# EasyEDA Pro project QUARTZ_01.eprj

# Schematic Schematic1
Board Name: Board1; Create Date: 2024-07-29; Company: wheatfox; Drawed: wheatfox; Reviewed: wheatfox
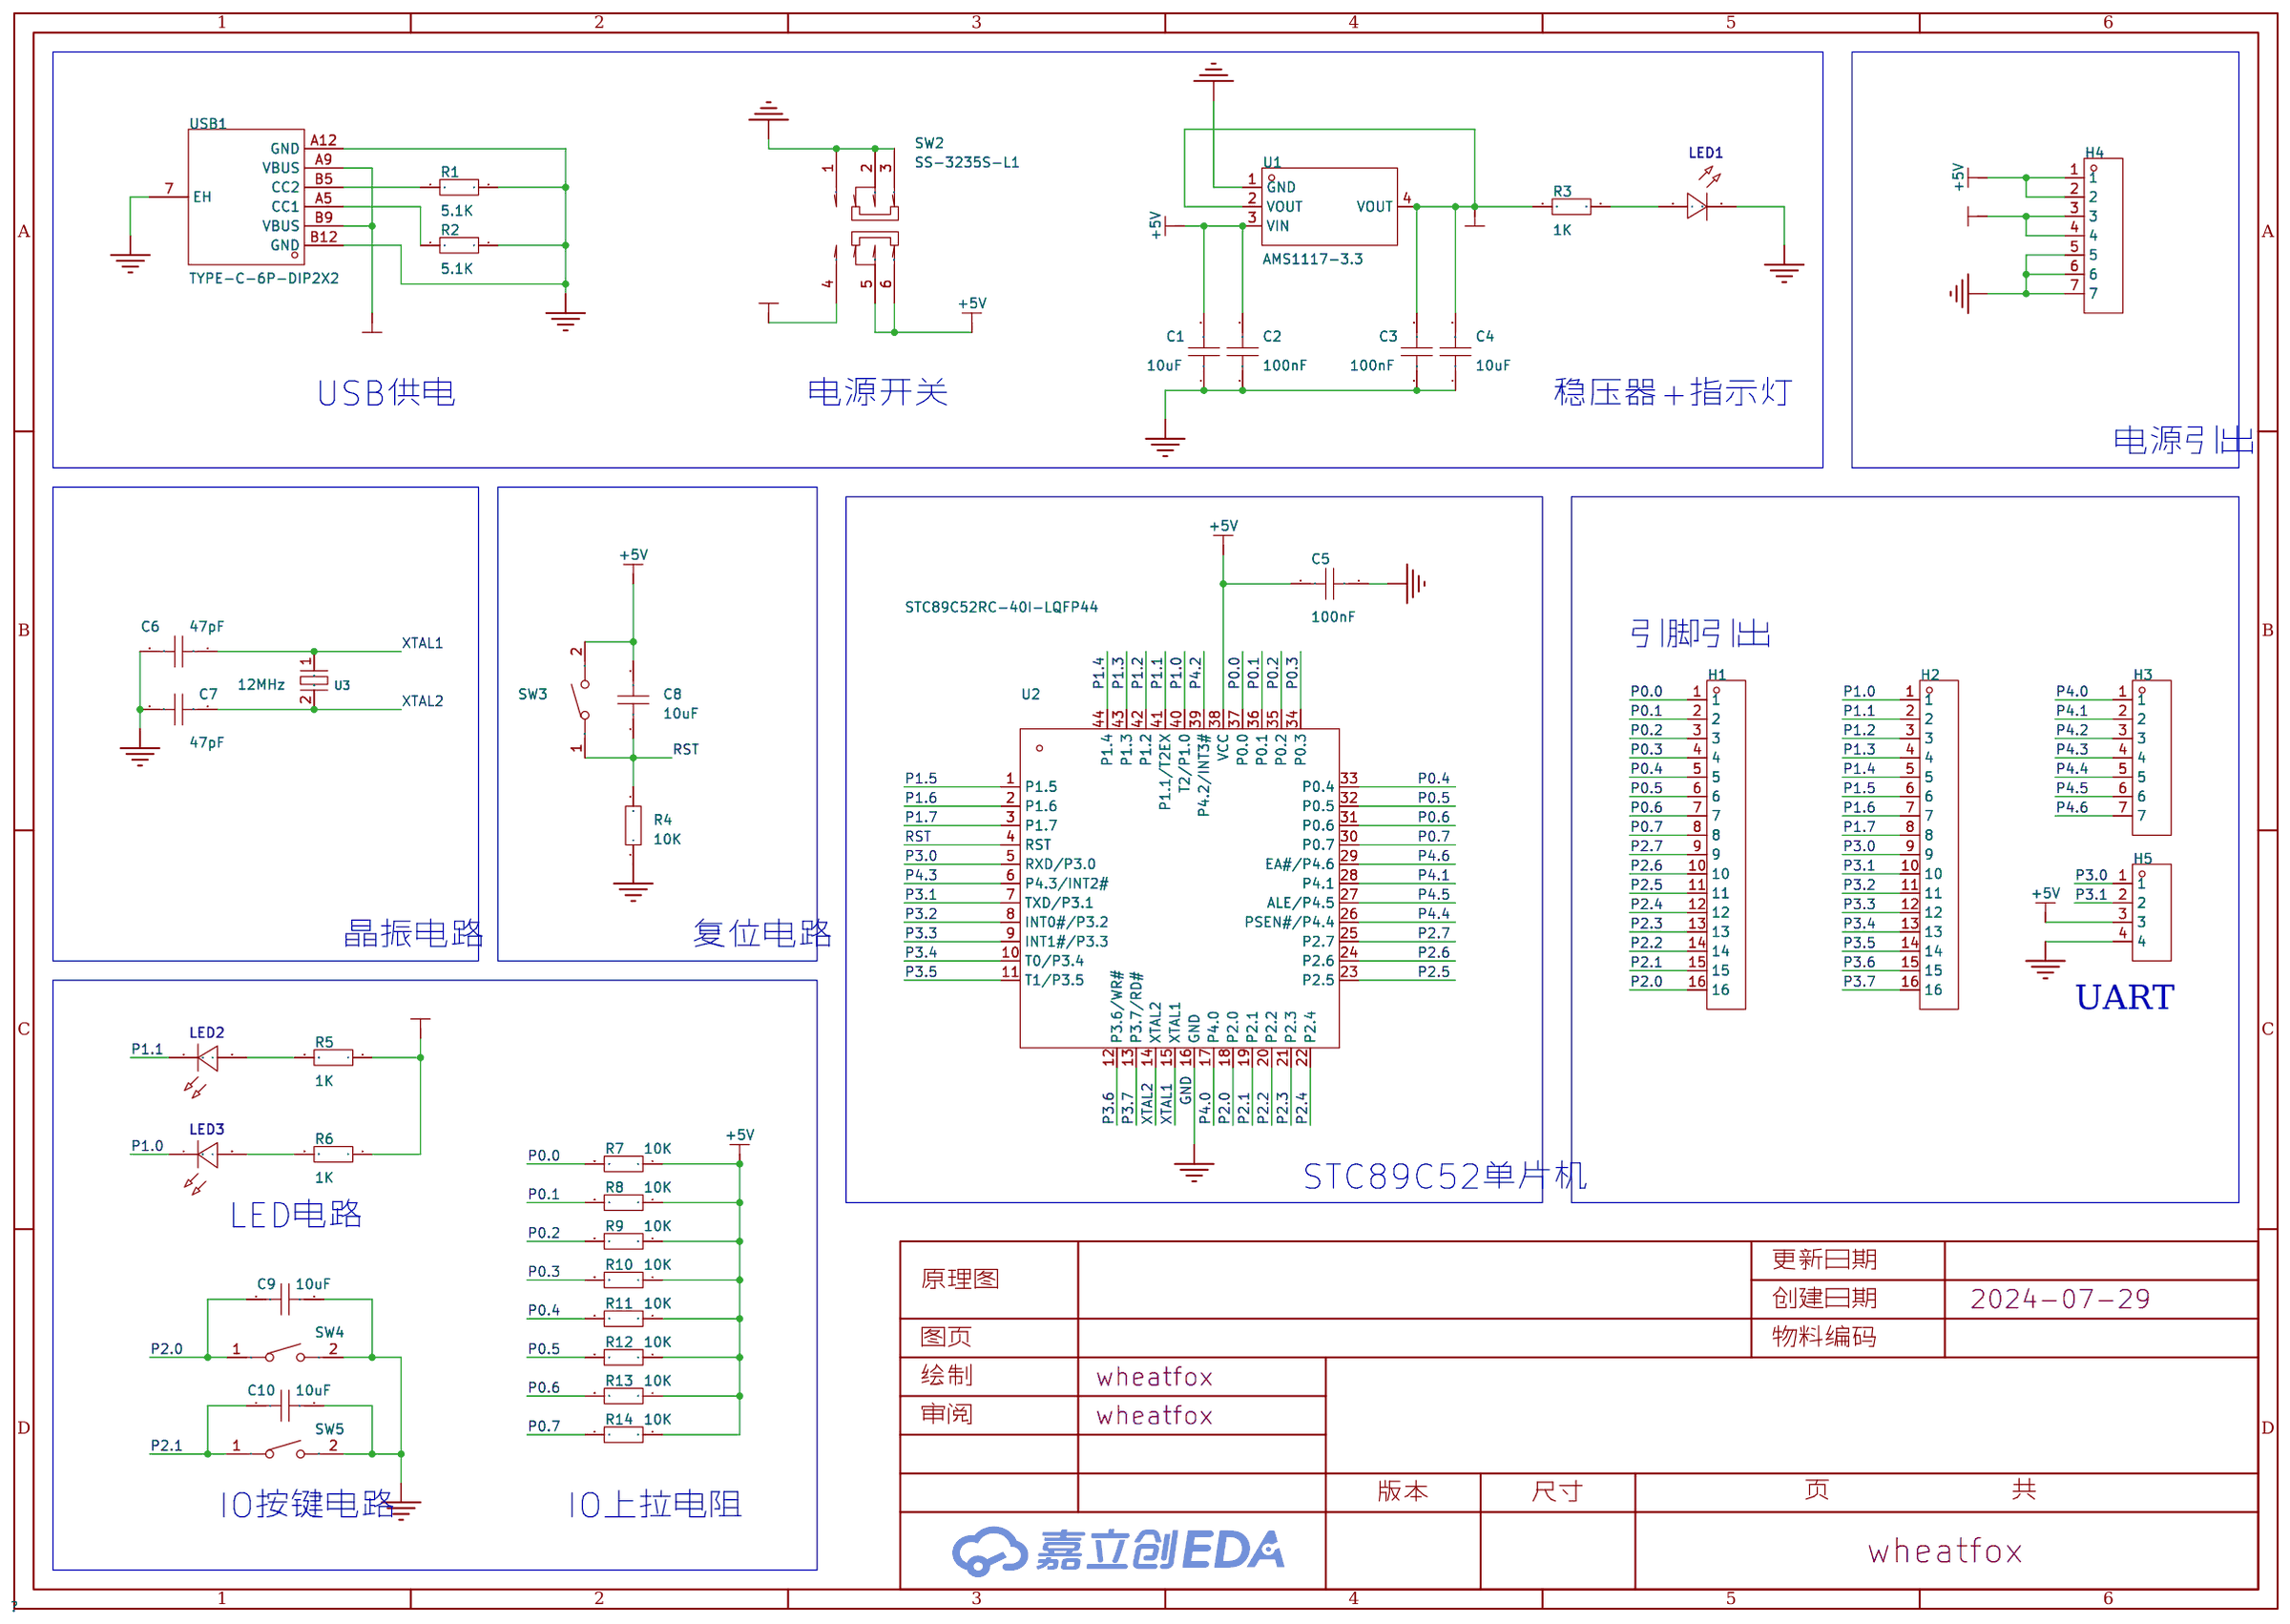
[diagram p0: schematic sheet]

## Parts
C1  10uF  [C0805]
C2  100nF  [C0805]
C3  100nF  [C0805]
C4  10uF  [C0805]
C5  100nF  [C0805]
C6  47pF  [C0805]
C7  47pF  [C0805]
C8  10uF  [C0805]
C9  10uF  [C0805]
C10  10uF  [C0805]
H1  -  [HDR-TH_16P-P2.54-V-M]
H2  -  [HDR-TH_16P-P2.54-V-M]
H3  -  [HDR-TH_7P-P2.54-V-M]
H4  -  [HDR-TH_7P-P2.54-V-M]
H5  -  [HDR-TH_4P-P2.54-V-M]
LED1  -  [LED_0805]
LED2  -  [LED_0805]
LED3  -  [LED_0805]
R1  5.1K  [R0805]
R2  5.1K  [R0805]
R3  1K  [R0805]
R4  10K  [R0805]
R5  1K  [R0805]
R6  1K  [R0805]
R7  10K  [R0805]
R8  10K  [R0805]
R9  10K  [R0805]
R10  10K  [R0805]
R11  10K  [R0805]
R12  10K  [R0805]
R13  10K  [R0805]
R14  10K  [R0805]
SW2  SS-3235S-L1  [SW-SMD_SS-3235S-LX]
SW3  轻触按键3*4*H  [SW-SMD_L4.0-W2.9-LS5.0]
SW4  轻触按键3*4*H  [SW-SMD_L4.0-W2.9-LS5.0]
SW5  轻触按键3*4*H  [SW-SMD_L4.0-W2.9-LS5.0]
U1  AMS1117-3.3  [SOT-223-3_L6.5-W3.4-P2.30-LS7.0-BR]
U2  STC89C52RC-40I-LQFP44  [LQFP-44_L10.0-W10.0-P0.80-LS12.0-BL]
U3  12MHz  [CRYSTAL-SMD_L11.4-W4.7-LS12.7]
USB1  TYPE-C-6P-DIP2X2  [TYPE-C-SMD_TYPE-C-6P]

## Library data of the parts
C1-C10 = CAP_0805: Supplier Footprint: 0805
H1 H2 = HDR-M_2.54_1x16P: Supplier Part: C2894939; Supplier Footprint: 插件
H3 H4 = HDR-M_2.54_1x7P: Supplier Part: C492406; Supplier Footprint: 插件
H5 = HDR-M_2.54_1x4P: Supplier Part: C492403; Supplier Footprint: 插件
LED1-LED3 = LED_0805-G: Supplier Footprint: 0805
R1-R14 = Res_0805: Supplier Footprint: 0805
SW2 = SS-3235S-L1: LCSC Part Name: 柄长2mm 卧贴双档 滑动开关; Supplier Part: C500055; Manufacturer: XKB Connectivity(中国星坤); Supplier Footprint: SMD; JLCPCB Part Class: 扩展库; Datasheet: https://atta.szlcsc.com/upload/public/pdf/source/20211011/39D516E750C13BE9339464E723D9F132.pdf; Supplier: LCSC; Circuit: 双刀双掷; Actuator Style: 矩形柱状; Pin Style: 鸥翼型; Switch Length: 9.1mm; Switch Width: 3.55mm; Switch Height: 3.2mm; Mounting Style: 卧贴; Actuator Color: 黑色; Current Rating (DC): 50mA; Voltage Rating (DC): 12V; Current Rating (AC): 50mA; Voltage Rating (AC): 12V; Mechanical Life: 1万次; Operating Temperature: -40℃~+85℃
SW3-SW5 = 轻触按键3*4*H: Supplier Part: C9900017573; Supplier Footprint: 轻触按键3*4*2.5; Supplier: LCSC
U1 = AMS1117-3.3_C6186: LCSC Part Name: 输出3.3V 1A; Supplier Part: C6186; Manufacturer: AMS; Supplier Footprint: SOT-223; JLCPCB Part Class: 基础库; Datasheet: https://atta.szlcsc.com/upload/public/pdf/source/20180727/C6186_7A095716F0823C02F1997A905E26C086.pdf; Supplier: LCSC; Output Type: 固定; Output Voltage: 3.3V; MAX Output Current: 1A; Power Supply Rejection Ratio (PSRR): 72dB@(120Hz); Dropout Voltage: 1.3V@(800mA); Output Polarity: 正极; Number of Outputs: 1
U2 = STC89C52RC-40I-LQFP44: Supplier Part: C8707; Manufacturer: STC(宏晶); Supplier Footprint: LQFP-44(10x10); JLCPCB Part Class: 扩展库; Datasheet: https://atta.szlcsc.com/upload/public/pdf/source/20131218/1457706663573.pdf; Supplier: LCSC; CPU Core: 51系列; Program Storage Size: 8KB; RAM Size: 512Byte; GPIO Ports Number: 39; Operating Voltage Range: 3.3V~5.5V; Program Memory Type: FLASH; Operating Temperature Range: -40℃~+85℃; 16Bit Timer: 3; UART/USART: 1; Peripheral/Function: 看门狗; Watchdog: 有
U3 = ABLS-12.000MHZ-B4H-T: LCSC Part Name: 12MHz ±30ppm 18pF; Supplier Part: C1986452; Manufacturer: ABRACON; Supplier Footprint: HC-49S-SMD; JLCPCB Part Class: 扩展库; Datasheet: https://atta.szlcsc.com/upload/public/pdf/source/20210612/96A8D0E14BE5C26ADD56CBF11909D043.pdf; Supplier: LCSC; Normal temperature Frequency Tolerance: ±30ppm; External load capacitor: 18pF; Frequency Stability(Full temperature range): ±35ppm; Equivalent Series Resistance (ESR): 50Ω; Operating Temperature: -20℃~+70℃
USB1 = TYPE-C-6P-DIP2X2: Supplier Part: C9900017627; Supplier Footprint: TYPE-C-6P; JLCPCB Part Class: 扩展库; Supplier: LCSC

## Nets
3.3V: C3.2 C4.2 H4.3 H4.4 R3.1 R5.1 R6.1 U1.2(VOUT) U1.4(VOUT)
+5V: C1.2 C2.2 C5.2 C8.1 H4.1 H4.2 H5.3 R7.1 R8.1 R9.1 R10.1 R11.1 R12.1 R13.1 R14.1 SW2.5 SW2.6 SW3.2 U1.3(VIN) U2.38(VCC)
GND: C1.1 C2.1 C3.1 C4.1 C5.1 C6.2 C7.2 C9.2 C10.2 H4.5 H4.6 H4.7 H5.4 LED1.1(C) R1.2 R2.2 R4.1 SW2.1 SW2.2 SW2.3 SW4.2 SW5.2 U1.1(GND) U2.16(GND) USB1.7(EH) USB1.A12(GND) USB1.B12(GND)
VCC+5V: SW2.4 USB1.A9(VBUS) USB1.B9(VBUS)
P0.0: H1.1 R7.2 U2.37(P0.0)
P0.1: H1.2 R8.2 U2.36(P0.1)
P0.2: H1.3 R9.2 U2.35(P0.2)
P0.3: H1.4 R10.2 U2.34(P0.3)
P0.4: H1.5 R11.2 U2.33(P0.4)
P0.5: H1.6 R12.2 U2.32(P0.5)
P0.6: H1.7 R13.2 U2.31(P0.6)
P0.7: H1.8 R14.2 U2.30(P0.7)
P1.0: H2.1 LED3.1(C) U2.40(T2/P1.0)
P1.1: H2.2 LED2.1(C) U2.41(P1.1/T2EX)
P1.2: H2.3 U2.42(P1.2)
P1.3: H2.4 U2.43(P1.3)
P1.4: H2.5 U2.44(P1.4)
P1.5: H2.6 U2.1(P1.5)
P1.6: H2.7 U2.2(P1.6)
P1.7: H2.8 U2.3(P1.7)
P2.0: C9.1 H1.16 SW4.1 U2.18(P2.0)
P2.1: C10.1 H1.15 SW5.1 U2.19(P2.1)
P2.2: H1.14 U2.20(P2.2)
P2.3: H1.13 U2.21(P2.3)
P2.4: H1.12 U2.22(P2.4)
P2.5: H1.11 U2.23(P2.5)
P2.6: H1.10 U2.24(P2.6)
P2.7: H1.9 U2.25(P2.7)
P3.0: H2.9 H5.1 U2.5(RXD/P3.0)
P3.1: H2.10 H5.2 U2.7(TXD/P3.1)
P3.2: H2.11 U2.8(INT0#/P3.2)
P3.3: H2.12 U2.9(INT1#/P3.3)
P3.4: H2.13 U2.10(T0/P3.4)
P3.5: H2.14 U2.11(T1/P3.5)
P3.6: H2.15 U2.12(P3.6/WR#)
P3.7: H2.16 U2.13(P3.7/RD#)
P4.0: H3.1 U2.17(P4.0)
P4.1: H3.2 U2.28(P4.1)
P4.2: H3.3 U2.39(P4.2/INT3#)
P4.3: H3.4 U2.6(P4.3/INT2#)
P4.4: H3.5 U2.26(PSEN#/P4.4)
P4.5: H3.6 U2.27(ALE/P4.5)
P4.6: H3.7 U2.29(EA#/P4.6)
RST: C8.2 R4.2 SW3.1 U2.4(RST)
XTAL1: C6.1 U2.15(XTAL1) U3.1
XTAL2: C7.1 U2.14(XTAL2) U3.2(GND)
$1N227: R1.1 USB1.B5(CC2)
$1N243: R2.1 USB1.A5(CC1)
$1N1205: LED1.2(A) R3.2
$1N3645: LED3.2(A) R6.2
$1N3649: LED2.2(A) R5.2

## Notes on the sheet
- USB供电
- 电源开关
- 稳压器+指示灯
- 电源引出
- 引脚引出
- 晶振电路
- 复位电路
- UART
- STC89C52单片机
- LED电路
- IO按键电路
- IO上拉电阻

# Board PCB1
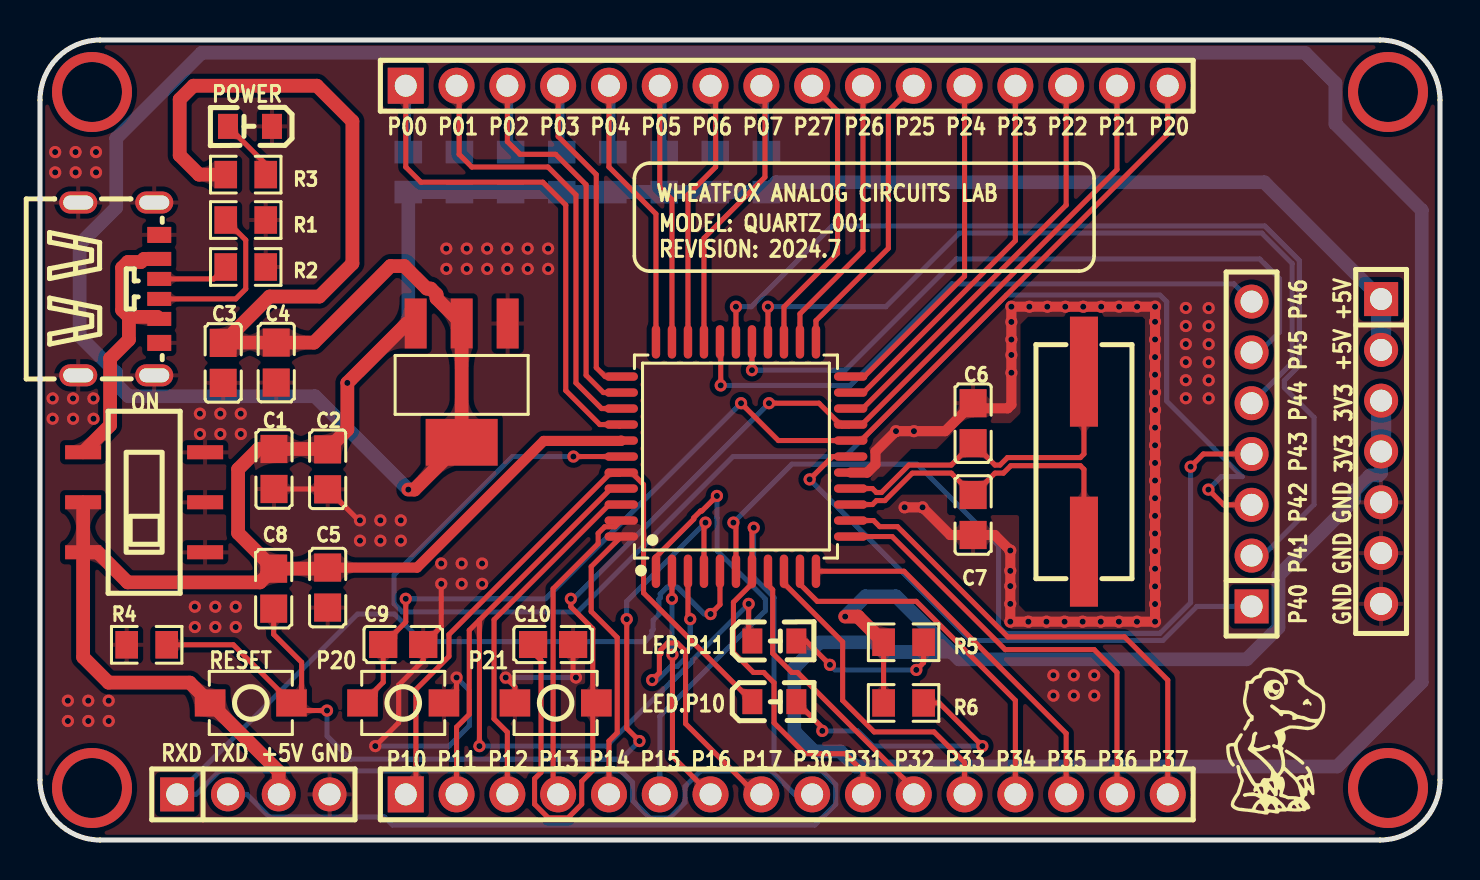
[diagram p1: board, top side]
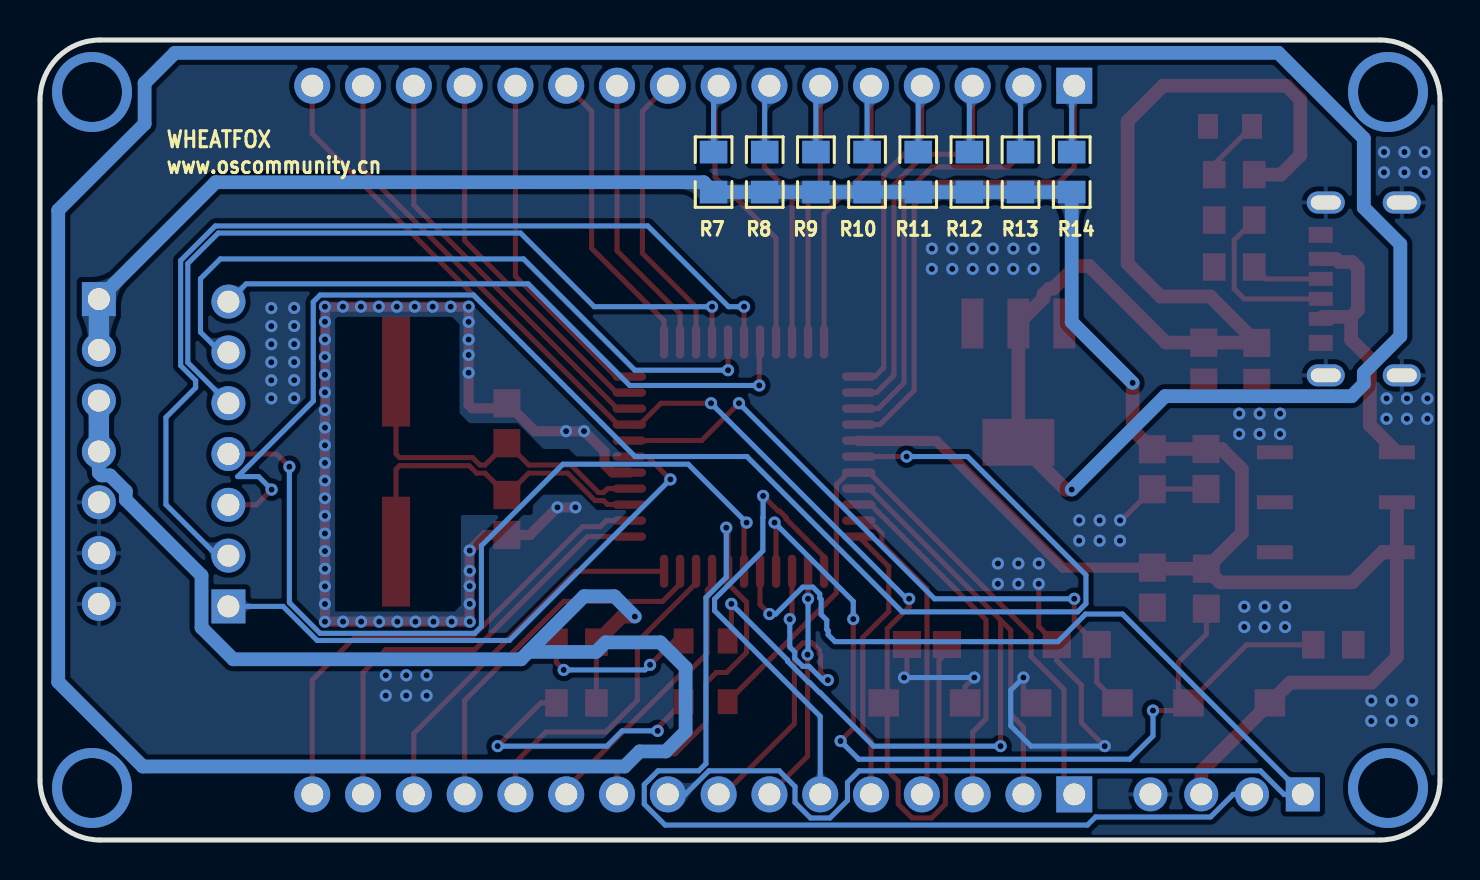
[diagram p2: board, bottom side, seen from below]

Outline 70 x 40 mm; copper layers: Top Layer, Bottom Layer. Coordinates in mm from the lower left corner of the outline.
Outline path: 0,37 0,3 arc(0.88,0.88) 3,0 67,0 arc(69.12,0.88) 70,3 70,37 arc(69.12,39.12) 67,40 3,40 arc(0.88,39.12) 0,37
Stack: Top Layer 0.035mm / Dielectric1 1.51mm FR4 er 4.5 / Bottom Layer 0.035mm

## Design rules (mm)
net XTAL2: DP1
net XTAL1: DP1
template: JLCPCB Capability(Two Layers Board)
spacing copperThickness1oz (default): track to track 0.102, other pairs 0.152 to 0.3
spacing copperThickness2oz: track to track 0.203, other pairs 0.152 to 0.3
track width copperThickness1oz (default): min 0.127, default 0.254, max 2.54
track width copperThickness2oz: min 0.203, default 0.254, max 2.54
differential pair differentialPair (default): width min 0.127, default 0.254, max 2.54; gap min 0.152, default 0.152
via viaSize (default): diameter min 0.5, default 0.61, max 10; hole min 0.3, default 0.305, max 6.3

## Placement (name value [footprint] x y rotation side)
C1  10uF  [C0805]  11.7 18.55 90 top
C2  100nF  [C0805]  14.38 18.53 90 top
C3  100nF  [C0805]  9.16 23.86 90 top
C4  10uF  [C0805]  11.81 23.87 90 top
C5  100nF  [C0805]  14.38 12.62 90 top
C6  47pF  [C0805]  46.66 20.84 90 top
C7  47pF  [C0805]  46.66 16.25 270 top
C8  10uF  [C0805]  11.68 12.57 270 top
C9  10uF  [C0805]  18.16 9.77 0 top
C10  10uF  [C0805]  25.65 9.77 0 top
H1  -  [HDR-TH_16P-P2.54-V-M]  37.34 37.71 0 top
H2  -  [HDR-TH_16P-P2.54-V-M]  37.34 2.28 0 top
H3  -  [HDR-TH_7P-P2.54-V-M]  60.58 19.3 90 top
H4  -  [HDR-TH_7P-P2.54-V-M]  67.06 19.43 270 top
H5  -  [HDR-TH_4P-P2.54-V-M]  10.67 2.28 0 top
LED1  -  [LED_0805]  10.45 35.69 180 top
LED2  -  [LED_0805]  36.77 9.95 0 top
LED3  -  [LED_0805]  36.77 6.91 0 top
R1  5.1K  [R0805]  10.29 31 0 top
R2  5.1K  [R0805]  10.29 28.65 0 top
R3  1K  [R0805]  10.29 33.27 0 top
R4  10K  [R0805]  5.33 9.76 0 top
R5  1K  [R0805]  43.18 9.89 0 top
R6  1K  [R0805]  43.18 6.85 0 top
R7  10K  [R0805]  18.41 33.4 90 bottom
R8  10K  [R0805]  20.97 33.4 90 bottom
R9  10K  [R0805]  23.53 33.4 90 bottom
R10  10K  [R0805]  26.09 33.4 90 bottom
R11  10K  [R0805]  28.65 33.4 90 bottom
R12  10K  [R0805]  31.21 33.4 90 bottom
R13  10K  [R0805]  33.76 33.4 90 bottom
R14  10K  [R0805]  36.32 33.4 90 bottom
SW2  SS-3235S-L1  [SW-SMD_SS-3235S-LX]  5.21 16.89 270 top
SW3  轻触按键3*4*H  [SW-SMD_L4.0-W2.9-LS5.0]  10.54 6.85 180 top
SW4  轻触按键3*4*H  [SW-SMD_L4.0-W2.9-LS5.0]  18.16 6.85 0 top
SW5  轻触按键3*4*H  [SW-SMD_L4.0-W2.9-LS5.0]  25.78 6.85 180 top
U1  AMS1117-3.3  [SOT-223-3_L6.5-W3.4-P2.30-LS7.0-BR]  21.08 22.86 90 top
U2  STC89C52RC-40I-LQFP44  [LQFP-44_L10.0-W10.0-P0.80-LS12.0-BL]  34.8 19.17 0 top
U3  12MHz  [CRYSTAL-SMD_L11.4-W4.7-LS12.7]  52.2 18.92 270 top
USB1  TYPE-C-6P-DIP2X2  [TYPE-C-SMD_TYPE-C-6P]  3.94 27.55 270 top

## Footprints (pads in the part's own frame, mm; a bottom-side part is the same pattern mirrored in y, then rotated)
C0805
  rect 1.41x1.35 smd: 1(-1,0) 2(1,0)
CRYSTAL-SMD_L11.4-W4.7-LS12.7
  rect 5.5x1.4 smd: 1(-4.5,0) 2(4.5,0)
HDR-TH_4P-P2.54-V-M
  rect 1.7x1.7 hole 1.1: 1(-3.81,0)
  round 1.7 hole 1.1: 2(-1.27,0) 3(1.27,0) 4(3.81,0)
HDR-TH_7P-P2.54-V-M
  rect 1.7x1.7 hole 1.1: 1(-7.62,0)
  round 1.7 hole 1.1: 2(-5.08,0) 3(-2.54,0) 4(0,0) 5(2.54,0) 6(5.08,0) 7(7.62,0)
HDR-TH_16P-P2.54-V-M
  rect 1.8x1.8 hole 1.1: 1(-19.05,0)
  round 1.8 hole 1.1: 2(-16.51,0) 3(-13.97,0) 4(-11.43,0) 5(-8.89,0) 6(-6.35,0) 7(-3.81,0) 8(-1.27,0) 9(1.27,0) 10(3.81,0) 11(6.35,0) 12(8.89,0) 13(11.43,0) 14(13.97,0) 15(16.51,0) 16(19.05,0)
LED_0805
  rect 1x1.25 smd: 1(-1.15,0.005) 2(1.05,0.005)
LQFP-44_L10.0-W10.0-P0.80-LS12.0-BL
  oval 0.42x1.67 smd: 1(-4,-5.735) 2(-3.2,-5.735) 3(-2.4,-5.735) 4(-1.6,-5.735) 5(-0.8,-5.735) 6(0,-5.735) 7(0.8,-5.735) 8(1.6,-5.735) 9(2.4,-5.735) 10(3.2,-5.735) 11(4,-5.735) 23(4,5.735) 24(3.2,5.735) 25(2.4,5.735) 26(1.6,5.735) 27(0.8,5.735) 28(0,5.735) 29(-0.8,5.735) 30(-1.6,5.735) 31(-2.4,5.735) 32(-3.2,5.735) 33(-4,5.735)
  oval 1.67x0.42 smd: 12(5.735,-4) 13(5.735,-3.2) 14(5.735,-2.4) 15(5.735,-1.6) 16(5.735,-0.8) 17(5.735,0) 18(5.735,0.8) 19(5.735,1.6) 20(5.735,2.4) 21(5.735,3.2) 22(5.735,4) 34(-5.735,4) 35(-5.735,3.2) 36(-5.735,2.4) 37(-5.735,1.6) 38(-5.735,0.8) 39(-5.735,0) 40(-5.735,-0.8) 41(-5.735,-1.6) 42(-5.735,-2.4) 43(-5.735,-3.2) 44(-5.735,-4)
R0805
  rect 1.133x1.377 smd: 1(-1,0) 2(1,0)
SOT-223-3_L6.5-W3.4-P2.30-LS7.0-BR
  rect 2.5x1.1 smd: 1(2.97,-2.3) 2(2.97,0) 3(2.97,2.3)
  rect 2.34x3.6 smd: 4(-2.97,0)
SW-SMD_L4.0-W2.9-LS5.0
  rect 1.53x1.36 smd: 1(-2.035,0) 2(2.035,0)
SW-SMD_SS-3235S-LX
  rect 0.7x1.8 smd: 1(-2.5,3.05) 2(0,3.05) 3(2.5,3.05) 4(-2.5,-3.05) 5(0,-3.05) 6(2.5,-3.05)
TYPE-C-SMD_TYPE-C-6P
  oval 1.1x1.9 hole 0.7x1.5: 7(-4.32,1.775) 7(-4.32,-2.025) 7(4.32,1.775) 7(4.32,-2.025)
  rect 0.7x1.2 smd: A5(-0.5,2.025) A9(1.5,2.025) B5(0.5,2.025) B9(-1.5,2.025)
  rect 0.8x1.2 smd: A12(2.7,2.025) B12(-2.7,2.025)

## Nets
As in the schematic.

## Via types
v1: diameter 4, hole 3, Top Layer to Bottom Layer, 4 vias
v2: diameter 0.61, hole 0.305, Top Layer to Bottom Layer, 156 vias

## Routing (per net, layer and track width the routed paths; a pad name or vN(x,y) marks a point on that pad's centre or on a via; arc(x,y) is an arc through that point)
3.3V: length 269.3
  Top Layer w0.254: R5.1 R6.1
  Top Layer w0.686: 9.18,24.87 C4.2 13.7,24.87 17.53,28.7 18.21,28.7 19.34,27.57 19.54,27.57 19.83,27.28 19.83,27.08 21.08,25.83 ; 9.18,24.87 11.48,27.17 13.97,27.17 15.62,28.82 15.62,35.94 13.84,37.71 7.67,37.71 6.98,37.03 6.98,34.23 7.95,33.27 R3.1 ; 9.18,24.87 C3.2 ; v2(40.26,11.17) 40.9,11.17 R5.1 ; v2(18.41,17.52) 18.72,17.52 U1.4 U1.2
  Bottom Layer w0.686: 45.58,9.41 42.8,12.19 41.28,12.19 v2(40.26,11.17) ; 45.58,9.41 42.2,9.41 41.72,9.88 38.98,9.88 37.72,8.62 37.72,5.42 38.71,4.43 40.02,4.43 40.77,3.68 64.86,3.68 69.09,7.9 69.09,31.49 64.77,35.81 64.77,37.84 63.25,39.36 8.09,39.36 3.81,35.08 3.81,31.62 1.98,29.79 1.98,25.19 3.81,23.36 3.81,22.8 4.42,22.19 13.75,22.19 v2(18.41,17.52) ; 45.58,9.41 45.95,9.03 60.34,9.03 61.92,10.62 61.92,13.23 65.71,17.01 65.71,17.44 66.5,18.23 66.93,18.23 67.06,18.36 H4.4
  Bottom Layer w1.016: H4.3 H4.4
+5V: length 135.1
  Top Layer w0.508: U2.38 29.04,19.95 25.19,19.95 18.85,13.62 C5.2
  Top Layer w0.686: SW2.6 2.88,14.39 4.39,12.88 11,12.88 C8.1 ; SW2.6 SW2.5 ; SW2.6 2.16,9.14 3.43,7.87 7.49,7.87 SW3.2 11.94,3.42 H5.3 ; C8.1 9.91,15.35 9.91,18.54 10.92,19.55 C1.2 14.37,19.55 C2.2 15.37,20.52 v2(15.37,22.86) 18.34,25.83 U1.3 ; C8.1 14.33,13.57 C5.2
  Bottom Layer w0.686: v2(15.37,22.86) 18.41,25.9 R7.1 R8.1 R9.1 R10.1 R11.1 R12.1 R13.1 R14.1 36.81,32.89 61.21,32.89 H4.1
  Bottom Layer w1.016: H4.1 H4.2
GND: length 85.3
  Top Layer w0.254: v2(23.29,8.12) 23.75,7.66 SW5.2 ; C10.2 26.65,8.27 v2(26.8,8.12) ; C1.1 14.37,17.55 C2.1 15.94,15.98 v2(16,15.98) ; SW4.2 20.83,7.48 v2(20.83,8.12) ; v2(16.76,4.69) 17.93,5.86 17.93,7.74 19.16,8.97 C9.2 20.06,10.68 v2(20.06,12.81)
  Top Layer w0.508: v2(43.23,16.63) v2(44.13,16.63) 45.51,15.25 C7.2 47.74,15.25 v2(48.51,14.47) v2(48.51,13.46) v2(48.51,12.69) v2(48.51,11.81) v2(48.51,10.92) v2(49.42,10.92) v2(50.32,10.92) v2(51.23,10.92) v2(52.13,10.92) v2(53.04,10.92) v2(53.94,10.92) v2(54.85,10.92) v2(55.75,10.92) v2(55.75,11.8) v2(55.75,12.68) v2(55.75,13.56) v2(55.75,14.44) v2(55.75,15.33) v2(55.75,16.21) v2(55.75,17.09) v2(55.75,17.97) v2(55.75,18.85) v2(55.75,19.74) v2(55.75,20.62) v2(55.75,21.5) v2(55.75,22.38) v2(55.75,23.26) v2(55.75,24.15) v2(55.75,25.03) v2(55.75,25.91) v2(55.75,26.67) v2(54.85,26.67) v2(53.96,26.67) v2(53.06,26.67) v2(52.16,26.67) v2(51.26,26.67) v2(50.37,26.67) v2(49.47,26.67) 48.57,26.67 ; 40.53,18.37 41.36,18.37 41.77,18.78 41.77,19.42 v2(42.8,20.44) v2(43.7,20.44) 45.26,20.44 C6.2 46.91,21.58 48.39,21.58 48.57,21.77 v2(48.57,23.36) v2(48.57,24.25) v2(48.57,25.02) v2(48.57,25.9) v2(48.57,26.67)
  Bottom Layer w0.254: v2(26.8,8.12) v2(23.29,8.12) ; v2(20.83,8.12) 21.46,7.49 21.46,5.71 20.45,4.69 v2(16.76,4.69)
  vias: v2(0.63,22.08) v2(0.63,21.06) v2(0.76,34.4) v2(0.76,33.38) v2(1.39,6.97) v2(1.39,5.95) v2(1.65,22.08) v2(1.65,21.06) v2(1.78,34.4) v2(1.78,33.38) v2(2.41,6.97) v2(2.42,5.95) v2(2.67,22.08) v2(2.67,21.06) v2(2.8,34.4) v2(2.8,33.38) v2(3.43,6.97) v2(3.44,5.95) v2(7.74,11.66) v2(7.74,10.65) v2(8,21.32) v2(8,20.3) v2(8.76,11.66) v2(8.77,10.65) v2(9.02,21.32) v2(9.02,20.3) v2(9.78,11.66) v2(9.79,10.65) v2(10.04,21.32) v2(10.04,20.3) v2(16,14.97) v2(17.02,15.98) v2(17.02,14.97) v2(18.04,15.98) v2(18.04,14.97) v2(20.06,13.82) v2(20.31,29.57) v2(20.32,28.56) v2(21.08,13.82) v2(21.08,12.81) v2(21.34,29.57) v2(21.34,28.56) v2(22.1,13.82) v2(22.11,12.81) v2(22.36,29.57) v2(22.36,28.56) v2(23.36,29.57) v2(23.37,28.56) v2(24.38,29.57) v2(24.39,28.56) v2(25.41,29.57) v2(25.41,28.56) v2(50.67,8.24) v2(50.67,7.22) v2(51.69,8.24) v2(51.69,7.22) v2(52.71,8.24) v2(52.71,7.22) v2(57.29,26.6) v2(57.29,25.7) v2(57.29,24.8) v2(57.29,23.89) v2(57.29,22.99) v2(57.29,22.09) v2(58.43,26.6) v2(58.43,25.69) v2(58.43,24.79) v2(58.43,23.89) v2(58.43,22.98) v2(58.43,22.08)
VCC+5V: length 13.9
  Top Layer w0.686: USB1.B9 5.2,29.05 5.05,28.9 4.39,28.9 4.11,28.61 4.11,26.5 4.45,26.16 5.86,26.16 USB1.A9 ; 4.44,26.16 4.44,25.01 3.5,24.07 3.5,20.73 SW2.4
(no net):
  vias: v1(2.6,37.4) v1(2.6,2.6) v1(67.4,37.4) v1(67.4,2.6)
P0.0: length 29
  Top Layer w0.254: U2.37 28.99,20.7 28.91,20.77 27.99,20.77 26.29,22.47 26.29,31.75 25.15,32.89 19.05,32.89 18.29,33.65 H1.1
  Bottom Layer w0.254: H1.1 18.41,37.59 R7.2
P0.1: length 25.7
  Top Layer w0.254: U2.36 28.08,21.57 26.8,22.86 26.8,32.25 25.4,33.65 21.59,33.65 20.96,34.28 20.96,37.59 H1.2
  Bottom Layer w0.254: H1.2 20.97,37.57 R8.2
P0.2: length 22.7
  Top Layer w0.254: H1.3 23.37,34.92 24,34.28 25.78,34.28 27.31,32.76 27.31,23.24 28.17,22.37 U2.35
  Bottom Layer w0.254: H1.3 23.53,37.55 R9.2
P0.3: length 19.7
  Top Layer w0.254: U2.34 28.26,23.17 27.81,23.62 27.81,33.27 25.91,35.17 H1.4
  Bottom Layer w0.254: R10.2 26.09,37.53 H1.4
P0.4: length 17.2
  Top Layer w0.254: H1.5 28.45,33.65 30.8,31.3 U2.33
  Bottom Layer w0.254: H1.5 28.65,37.51 R11.2
P0.5: length 16.5
  Top Layer w0.254: H1.6 30.99,32.63 31.6,32.02 U2.32
  Bottom Layer w0.254: H1.6 31.21,37.5 R12.2
P0.6: length 16.9
  Top Layer w0.254: U2.31 32.4,32.27 33.78,33.65 33.78,37.46 H1.7
  Bottom Layer w0.254: R13.2 33.76,37.48 H1.7
P0.7: length 17.6
  Top Layer w0.254: H1.8 36.25,37.53 36.25,33.14 33.2,30.09 U2.30
  Bottom Layer w0.254: R14.2 36.32,37.46 H1.8
P1.0: length 35.3
  Top Layer w0.254: LED3.1 30.18,12.36 30.18,17.77 29.58,18.37 U2.40 28.97,18.28 28.46,18.28 20.45,10.27 20.45,9.18 18.8,7.53 18.8,2.79 H2.1
P1.1: length 43.7
  Top Layer w0.254: 21.97,11 21.46,10.49 21.46,6.28 20.83,5.64 H2.2 ; 21.97,11 28.55,17.57 U2.41 ; 21.97,11 v2(21.97,4.69) ; LED2.1 35.43,10.13 v2(35.43,11.81)
  Bottom Layer w0.254: v2(21.97,4.69) 28.32,4.69 31,7.37 31.02,7.37 31.53,7.88 31.57,7.88 32.62,8.93 32.62,8.99 v2(35.43,11.81)
P1.2: length 17.8
  Top Layer w0.254: H2.3 23.37,5.39 22.7,6.06 22.7,11.01 28.46,16.77 U2.42
P1.3: length 15.5
  Top Layer w0.254: H2.4 25.65,2.53 25.65,12.56 27.91,14.82 27.91,15.33 28.24,15.66 28.75,15.66 U2.43
P1.4: length 14.2
  Top Layer w0.254: U2.44 27.56,13.67 27.56,11.42 28.86,10.12 28.86,5.36 28.45,4.95 H2.5
P1.5: length 23.2
  Top Layer w0.254: U2.1 30.8,14.16 32.69,16.05 32.69,16.11 33.03,16.45 33.1,16.45 v2(33.85,17.2)
  Bottom Layer w0.254: v2(33.85,17.2) 33.85,16.12 33.86,16.11 33.86,14.46 36.27,12.05 36.27,11.46 30.99,6.18 H2.6
P1.6: length 12
  Top Layer w0.254: v2(31.62,9.27) 31.62,4.19 H2.7 ; U2.2 v2(31.6,12.06)
  Bottom Layer w0.254: v2(31.62,9.27) 31.6,9.29 v2(31.6,12.06)
P1.7: length 18.7
  Top Layer w0.254: v2(32.51,11.04) 32.4,11.16 U2.3 ; H2.8 35.81,2.28 32.28,5.82 32.28,9.44 31.87,9.85 31.38,9.85 31.04,9.51 31.04,9.31 30.97,9.24 30.97,8.36 v2(30.61,8)
  Bottom Layer w0.254: v2(30.61,8) 30.86,8 31.55,8.68 31.87,8.68 32.26,9.08 32.26,9.39 32.51,9.65 v2(32.51,11.04)
P2.0: length 57.8
  Top Layer w0.254: SW4.1 17.16,7.89 C9.1 18.29,10.9 v2(18.29,12.06) ; v2(35.05,21.84) 36.92,19.97 41.05,19.97 56.39,35.31 H1.16
  Bottom Layer w0.254: v2(18.29,12.06) 25.27,12.06 v2(35.05,21.84)
P2.1: length 63.5
  Top Layer w0.254: v2(26.54,12.06) 26.54,11.66 27.64,10.56 27.64,3.48 27.09,2.93 27.09,1.79 26.4,1.1 25.42,1.1 24.73,1.79 24.73,3.06 25.05,3.39 25.05,8.98 24.65,9.38 C10.1 ; H1.15 53.85,33.52 41.1,20.77 40.53,20.77 40.46,20.7 40.09,20.7 38.95,21.84 v2(36.45,21.84)
  Bottom Layer w0.254: v2(36.45,21.84) 26.67,12.06 v2(26.54,12.06)
P2.2: length 21
  Top Layer w0.254: 40.53,21.57 41.13,21.57 51.31,31.75 H1.14
P2.3: length 19.1
  Top Layer w0.254: H1.13 48.77,29.97 41.17,22.37 40.53,22.37
P2.4: length 17.3
  Top Layer w0.254: 40.53,23.17 41.21,23.17 46.23,28.19 H1.12
P2.5: length 14.8
  Top Layer w0.254: U2.23 38.8,25.97 42.42,29.59 42.42,36.44 H1.11
P2.6: length 14.1
  Top Layer w0.254: H1.10 41.15,29.46 38,26.31 U2.24
P2.7: length 14.5
  Top Layer w0.254: U2.25 37.2,25.41 37.15,25.46 37.2,25.51 37.2,26.65 39.88,29.33 39.88,36.44 H1.9
P3.0: length 71.6
  Top Layer w0.254: U2.5 34,11.77 v2(33.53,11.3)
  Bottom Layer w0.254: v2(33.53,11.3) 33.21,11.3 31.87,12.64 31.36,12.64 31.01,12.3 31.01,12.1 30.94,12.03 30.94,11.28 30.66,10.99 30.66,10.53 30.59,10.46 30.59,10.26 30.25,9.92 19.1,9.92 17.72,11.3 15.88,11.3 H5.1 7.8,2.28 8.98,3.46 29.05,3.46 29.63,2.88 29.63,1.97 30.5,1.1 31.48,1.1 32.25,1.88 32.25,2.67 33.04,3.46 36.56,3.46 37.74,2.28 H2.9
P3.1: length 66.1
  Top Layer w0.254: v2(35.69,15.62) 35.6,15.53 U2.7 35.6,12.81 34.67,11.89 34.67,9.38 35.67,8.38 36.19,8.38 36.7,7.86 36.7,5.85 38.24,4.31 40.26,4.31 41.15,3.42 H2.10
  Bottom Layer w0.254: H5.2 10.34,2.28 11.47,1.15 17.22,1.15 17.63,0.75 38.74,0.75 39.79,1.79 39.79,2.77 39.1,3.46 37.06,3.46 36.7,3.82 36.7,12.12 35.69,13.14 v2(35.69,15.62)
P3.2: length 13.8
  Top Layer w0.254: 36.4,12.87 36.4,12.75 36.63,12.51 36.63,9.33 37.59,8.38 37.88,8.38 43.69,2.56 H2.11
P3.3: length 16.7
  Top Layer w0.254: U2.9 37.2,12.83 40.13,9.9 40.13,6.98 41.71,5.4 44.7,5.4 46.23,3.88 H2.12
P3.4: length 18.5
  Top Layer w0.254: U2.10 38,12.8 38.86,11.93 43.81,11.93 48.77,6.98 H2.13
P3.5: length 18.9
  Top Layer w0.254: H2.14 51.31,5.33 43.2,13.44 U2.11
P3.6: length 22.2
  Top Layer w0.254: 40.53,15.17 42.61,15.17 48.26,9.52 52.71,9.52 53.85,8.38 H2.15
P3.7: length 24.9
  Top Layer w0.254: 40.53,15.97 41.68,15.97 41.99,15.67 42.88,15.67 48.39,10.16 54.23,10.16 56.39,8 H2.16
P4.0: length 28.7
  Top Layer w0.254: v2(38.48,18.03) 39.62,19.17 40.53,19.17
  Bottom Layer w0.254: H3.1 57.84,11.68 56.14,9.98 46.53,9.98 v2(38.48,18.03)
P4.1: length 49.6
  Top Layer w0.254: U2.28 v2(34.8,26.67)
  Bottom Layer w0.254: H3.2 61.15,14.22 63.7,16.77 63.7,21.13 62.22,22.61 62.22,22.97 62.97,23.72 62.97,28.97 61.23,30.7 39.61,30.7 35.57,26.67 v2(34.8,26.67)
P4.2: length 75.5
  Top Layer w0.254: H3.3 59.18,16.76 v2(58.42,17.52) ; U2.39 v2(26.67,19.17)
  Bottom Layer w0.254: v2(26.67,19.17) 23.62,19.17 17.7,13.25 17.7,11.82 18.12,11.41 26.88,11.41 34.65,19.17 40.25,19.17 48.33,27.25 55.99,27.25 56.34,26.91 56.34,21.94 60.11,18.17 59.07,18.17 v2(58.42,17.52)
P4.3: length 43.2
  Top Layer w0.254: H3.4 58.17,19.3 v2(57.53,18.66) ; U2.6 34.8,15.74 v2(34.67,15.87)
  Bottom Layer w0.254: v2(34.67,15.87) 37.59,18.79 43.85,18.79 47.93,14.72 47.93,10.67 48.27,10.33 56,10.33 57.53,11.87 v2(57.53,18.66)
P4.4: length 38
  Top Layer w0.254: U2.26 v2(36.4,26.67)
  Bottom Layer w0.254: H3.5 62.61,23.87 62.61,28.82 61.09,30.35 45.97,30.35 42.29,26.67 v2(36.4,26.67)
P4.5: length 35
  Top Layer w0.254: U2.27 v2(35.6,23.49)
  Bottom Layer w0.254: H3.6 60.96,24.38 61.98,25.39 61.98,28.06 60.99,29.05 45.82,29.05 40.26,23.49 v2(35.6,23.49)
P4.6: length 31.2
  Top Layer w0.254: U2.29 34.04,24.87 v2(34.04,22.73)
  Bottom Layer w0.254: v2(34.04,22.73) 40.51,22.73 45.59,27.81 59.69,27.81 H3.7
RST: length 47.9
  Top Layer w0.254: SW3.1 13.08,7.36 13.08,8.89 11.68,10.28 C8.2 ; SW3.1 9.67,9.76 R4.2 ; SW3.1 12.96,6.47 v2(14.35,6.47) ; U2.4 33.2,15.79 v2(33.27,15.87) ; v2(29.97,4.95) 29.34,5.58 v2(29.34,11.04)
  Bottom Layer w0.254: v2(33.27,15.87) 29.34,11.93 v2(29.34,11.04) ; v2(14.35,6.47) 14.35,5.2 15.51,4.04 29.06,4.04 v2(29.97,4.95)
XTAL1: length 17.6
  Top Layer w0.254: 40.53,17.57 41.62,17.57 41.82,17.38 42.07,17.38 43.45,18.75 45.56,18.75 C6.1 47.75,18.75 48,18.75 48.37,19.12 52.02,19.12 52.2,19.3 U3.1
XTAL2: length 17.6
  Top Layer w0.254: 40.53,16.77 41.62,16.77 41.82,16.97 42.24,16.97 43.61,18.34 45.56,18.34 C7.1 47.75,18.34 48.17,18.34 48.54,18.72 52.02,18.72 52.2,18.53 U3.2
$1N227: length 8.4
  Top Layer w0.254: USB1.B5 9.79,27.05 10.29,27.55 10.29,30 R1.1
$1N243: length 3.6
  Top Layer w0.254: R2.1 8.69,28.05 USB1.A5
$1N1205: length 3.2
  Top Layer w0.254: LED1.2 11.29,33.79 R3.2
$1N3645: length 14.1
  Top Layer w0.254: v2(47.12,4.69) 44.96,6.85 R6.2 ; LED3.2 39.12,5.62 v2(39.12,5.46)
  Bottom Layer w0.254: v2(47.12,4.69) 41.66,4.69 40.89,5.46 v2(39.12,5.46)
$1N3649: length 8.1
  Top Layer w0.254: LED2.2 38.3,9.95 v2(39.5,8.76) ; R5.2 44.18,8.87 v2(43.81,8.5)
  Bottom Layer w0.254: v2(43.81,8.5) 39.75,8.5 v2(39.5,8.76)

## Copper pours and planes (outline as drawn; the poured copper is in the pictures)
GND on Top Layer: -2.03,41.91 72.64,41.91 72.64,-2.04 -2.03,-2.04
GND on Bottom Layer: -2.67,42.54 73.41,42.54 73.41,-2.8 -2.67,-2.8

Small or netless copper shapes (teardrops, artwork), in the pictures only: 268 on Top Layer, 82 on Bottom Layer

## Text on the board
Bottom Silkscreen Layer: WHEATFOX / www.oscommunity.cn
Top Silkscreen Layer: ON | RXD | RESET | TXD | POWER | +5V | GND | P20 | P10 | P00 | P11 | P01 | P21 | P12 | P02 | P13 | P03 | P14 | P04 | P15 | P05 | LED.P11 | LED.P10 | WHEATFOX ANALOG CIRCUITS LAB | MODEL: QUARTZ_001 / REVISION: 2024.7 | P16 | P06 | P17 | P07 | P30 | P27 | P31 | P26 | P32 | P25 | P33 | P24 | P34 | P23 | P35 | P22 | P36 | P37 | P46 | P45 | P44 | P43 | P42 | P41 | P40 | 3V3
